# EAGLE design Encoder Rev 3 (pro micro) (EAGLE 6.2)
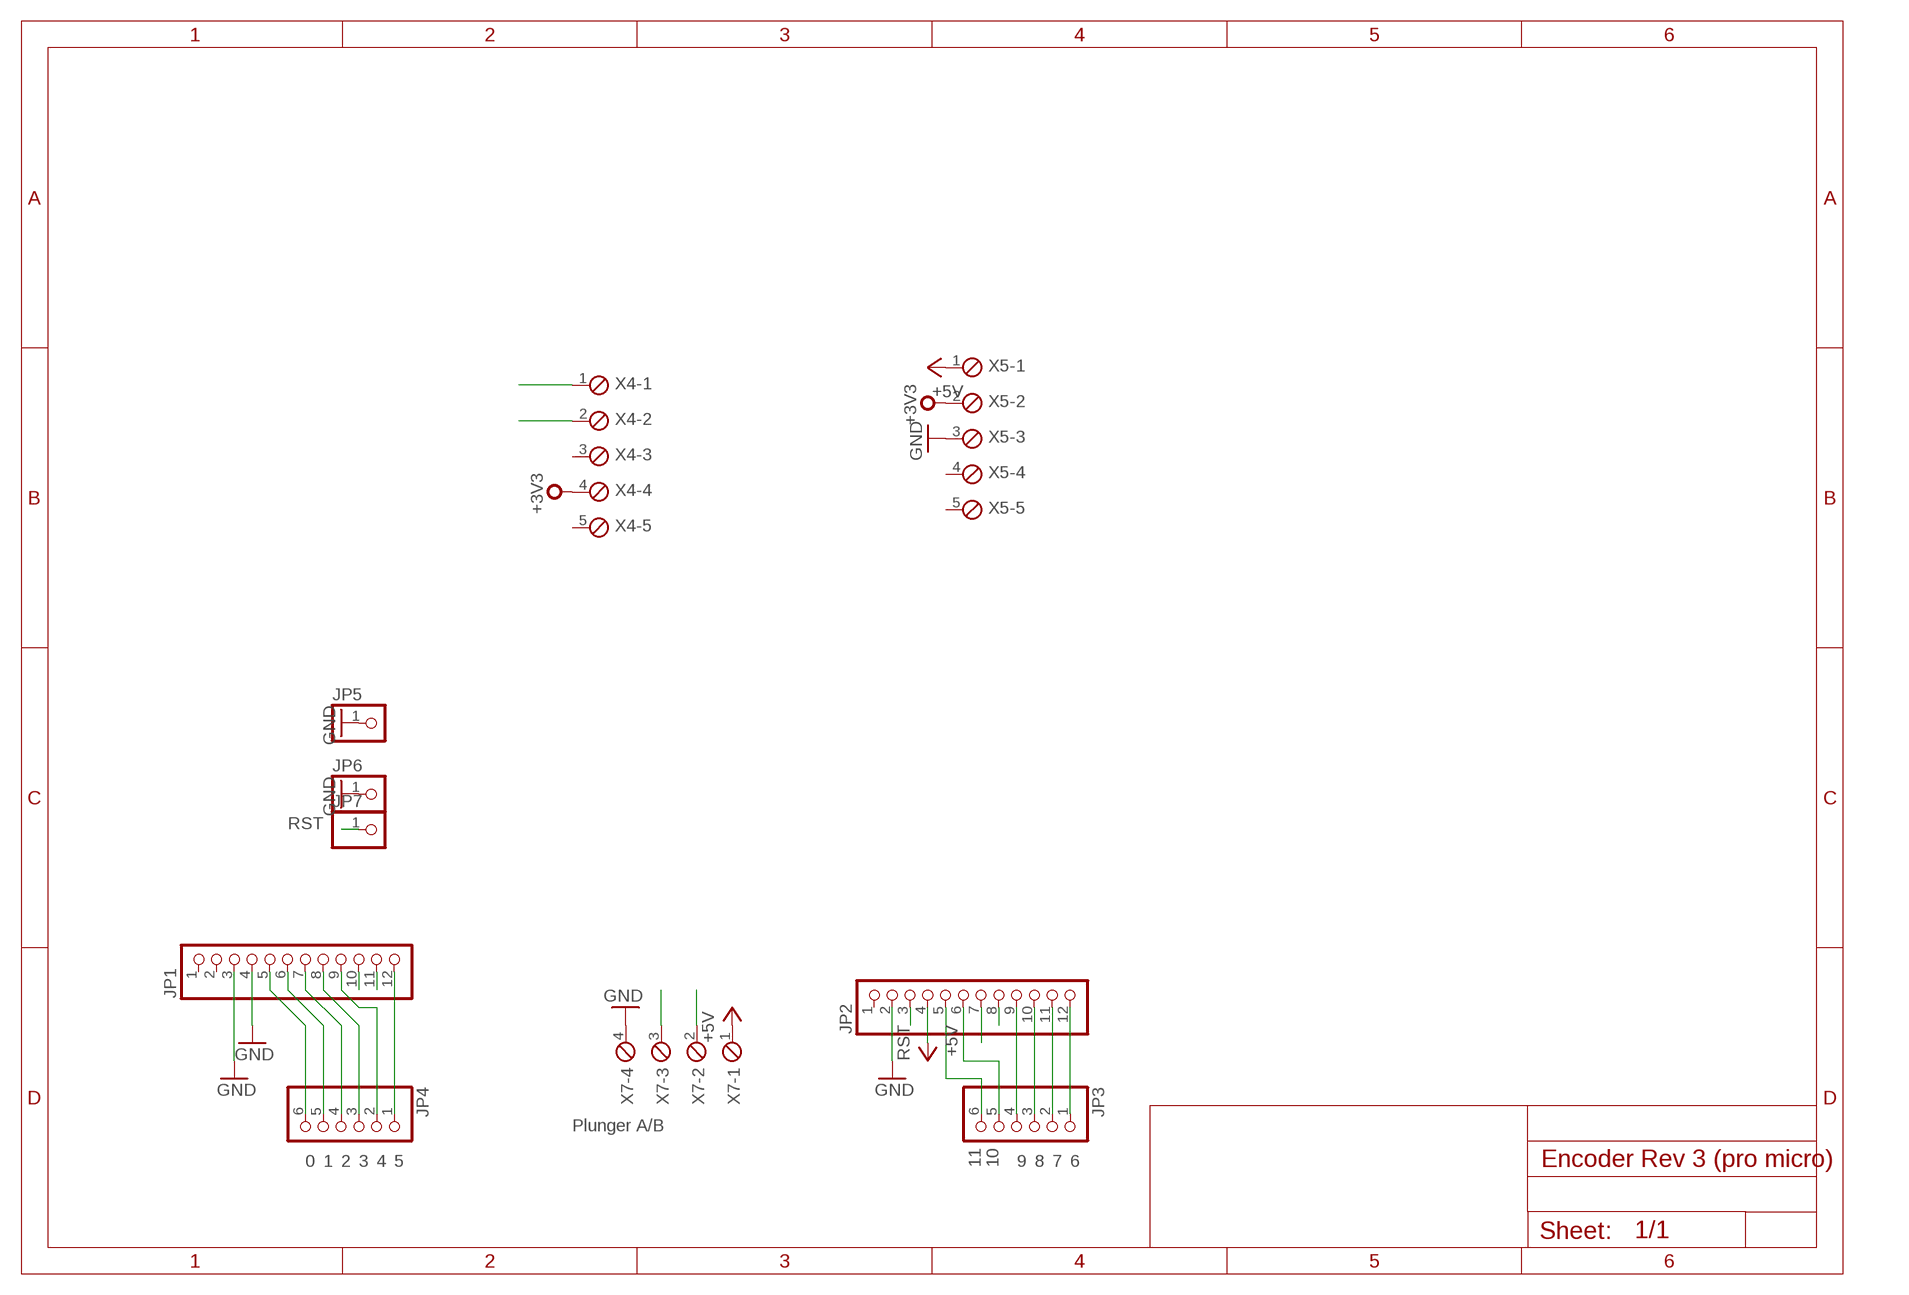
[diagram p0: schematic, sheet 1]

## Parts
JP1  PINHD-1X12-CB  [1X12-CB]
JP2  PINHD-1X12-CB  [1X12-CB]
JP3  PINHD-1X6B  [1X06-BIG]
JP4  PINHD-1X6B  [1X06-BIG]
JP5  PINHD-1X1CB  [1X01-CLEANBIG]
JP6  PINHD-1X1CB  [1X01-CLEANBIG]
JP7  PINHD-1X1CB  [1X01-CLEANBIG]
X4  MPT5  [5POL254]
X5  MPT5  [5POL254]
X7  MPT4  [4POL254]

## Nets
+3V3: X4.4 X5.2
+5V: JP2.4 X5.1 X7.1
A: JP1.10 X7.3
B: JP1.11 X7.2
GND: JP1.3 JP1.4 JP2.2 JP5.1 JP6.1 X5.3 X7.4
N$1: JP1.12 JP4.1
N$2: JP1.9 JP4.2
N$3: JP1.8 JP4.3
N$4: JP1.7 JP4.4
N$5: JP1.6 JP4.5
N$6: JP1.5 JP4.6
N$7: JP2.12 JP3.1
N$8: JP2.11 JP3.2
N$9: JP2.10 JP3.3
N$10: JP2.9 JP3.4
N$11: JP2.6 JP3.5
N$12: JP2.5 JP3.6
RST: JP2.3 JP7.1
XOUT: JP2.8 X4.1
YOUT: JP2.7 X4.2
Unconnected: JP1.1 JP1.2 JP2.1 X4.3 X4.5 X5.4 X5.5

## Notes on the sheet
- RST
- RST
- Plunger A/B
- 0 | 1 | 2 | 3 | 4 | 5 | 11 | 10 | 9 | 8 | 7 | 6

## Library data of the parts
JP1 JP2 = adafruit:PINHD-1X12: PIN HEADER
JP3 JP4 = adafruit:PINHD-1X6: PIN HEADER
JP5-JP7 = adafruit:PINHD-1X1: Pin header 1x1 for 0.1" spacing With round pins
X4 X5 = con-phoenix-254:MPT5: PHOENIX CONNECTOR; OC_FARNELL: unknown; OC_NEWARK: unknown
X7 = con-phoenix-254:MPT4: PHOENIX CONNECTOR; OC_FARNELL: unknown; OC_NEWARK: unknown

## Net classes
0 default: width 0.152 mm, clearance 0.203 mm

## Board
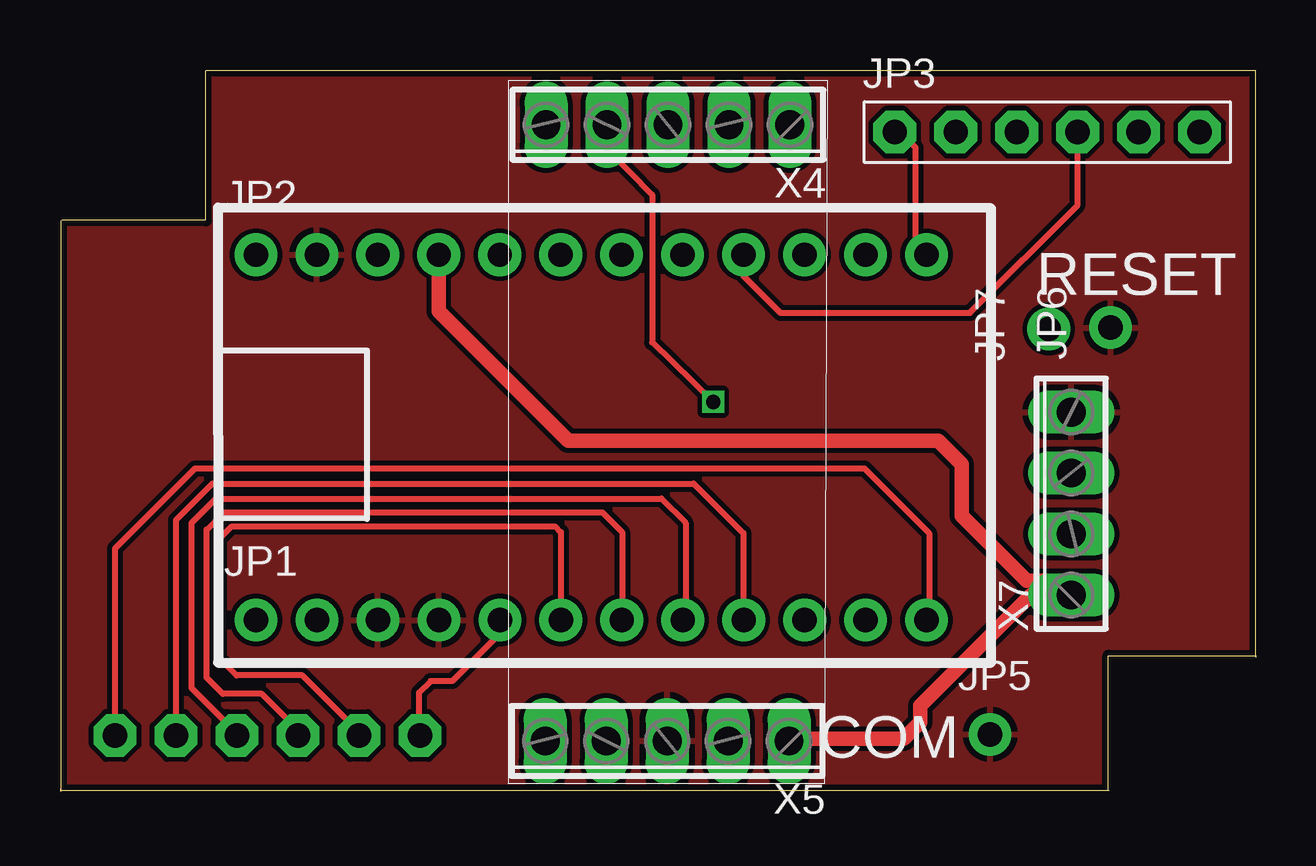
[diagram p1: board, top side]
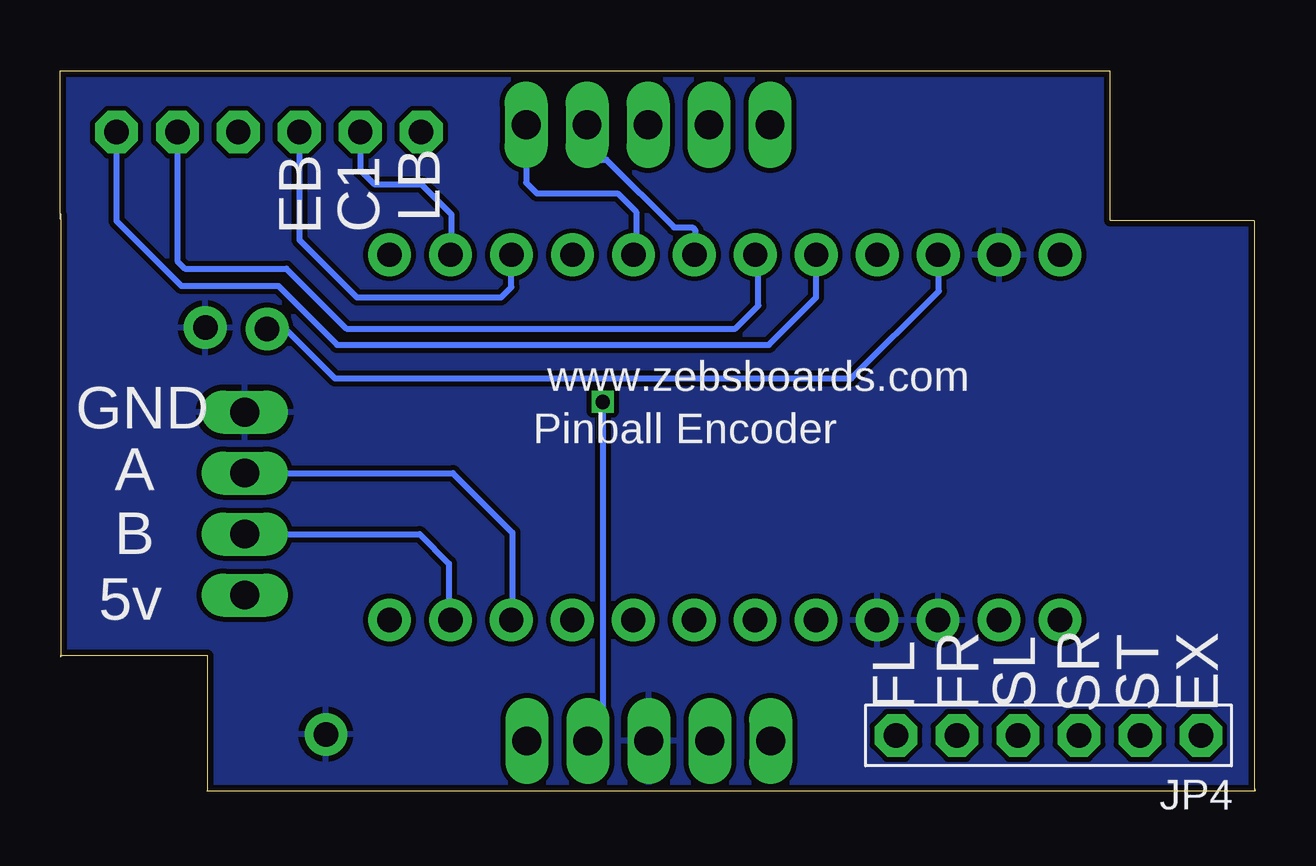
[diagram p2: board, bottom side, seen from below]

Size 49.83 x 30.01 mm. Coordinates in mm from the lower left corner, seen from the top.
Outline: 6.08,23.76 0.08,23.76
Outline: 6.07,23.76 6.07,30.01 49.83,30.01 49.83,23.8
Outline: 3.98,0 0.06,0
Outline: 0,0 0.06,0
Outline: 0.06,0 0.06,23.76
Outline: 43.68,0 43.68,5.62 49.83,5.62 49.83,5.57
Outline: 43.72,0 0.04,0 0.04,0.08
Outline: 49.81,24.05 49.81,5.59
Copper layers (1*16): Top 0.035mm / dielectric 1.5mm / Bottom 0.035mm
Design rules: minimum track width 6mil, minimum drill 12mil, track to track 6mil, track to pad 6mil, pad to pad 6mil, via to via 6mil, smd to smd 0mil, copper to edge 10mil, drill to drill 10mil, minimum pad ring 10mil, minimum via ring 6mil, stop-mask expansion 2mil, vias tented up to drill 100mil, thermal gap 10mil

### Footprints (pad centres in the part's own frame; a part is rotated, then mirrored left to right if it is on the bottom)
1X12-CB = drill 1.016 pad 1.778: 1 -13.97,0; 2 -11.43,0; 3 -8.89,0; 4 -6.35,0; 5 -3.81,0; 6 -1.27,0; 7 1.27,0; 8 3.81,0; 9 6.35,0; 10 8.89,0; 11 11.43,0; 12 13.97,0
1X06-BIG = drill 1.016 pad 1.778 octagon: 1 -6.35,0; 2 -3.81,0; 3 -1.27,0; 4 1.27,0; 5 3.81,0; 6 6.35,0
1X01-CLEANBIG = drill 1.016 pad 1.778: 1 0,0
5POL254 = drill 1.2 long: 1 -5.08,0; 2 -2.54,0; 3 0,0; 4 2.54,0; 5 5.08,0
4POL254 = drill 1.2 long: 1 -3.81,0; 2 -1.27,0; 3 1.27,0; 4 3.81,0

### Placement (x,y rotation side)
JP1  22.14,7.11 0 top
JP2  22.13,22.33 0 top
JP3  41.13,27.44 0 top
JP4  8.65,2.31 180 bottom
JP5  38.75,2.35 0 top
JP6  43.78,19.3 90 top
JP7  41.2,19.24 90 top
X4  25.33,27.75 180 top
X5  25.3,2.07 180 top
X7  42.13,11.97 90 top

### Tracks (layer width: path | path; a pad name or v marks a point on that pad's centre or on a via)
+3V3  (via drill 0.6)
  Top 0.254: X4.4 22.79,26.78 24.67,24.84 24.67,18.68 v27.22,16.2
  Bottom 0.254: v27.22,16.2 27.22,2.65 X5.2
+5V
  Top 0.61: X5.1 30.46,2.16 35.15,2.16 35.84,2.85 35.84,3.54 40.45,8.16 X7.1 41.54,8.74 40.28,8.74 37.57,11.46 37.57,13.6 36.59,14.58 21.18,14.58 15.78,19.98 JP2.4
A
  Bottom 0.254: X7.3 33.46,13.24 30.98,10.75 30.98,7.16 JP1.10
B
  Bottom 0.254: X7.2 34.85,10.7 33.62,9.47 33.62,7.17 JP1.11
GND
  pour Top: -0.09,30.61 50.86,30.61 50.86,-1.65 -0.1,-1.65 -0.1,30.6
  pour Bottom: -0.04,30.23 50.25,30.23 50.25,-0.44 -0.06,-0.44 -0.06,30.22
N$1
  Top 0.254: JP4.1 2.29,10.1 5.63,13.43 33.52,13.43 36.21,10.73 36.21,7.22 JP1.12
N$2
  Top 0.254: JP4.2 4.83,11.29 6.35,12.8 26.4,12.8 28.47,10.73 28.47,7.13 JP1.9
N$3
  Top 0.254: JP4.3 7.38,2.38 5.48,4.28 5.48,11.17 6.49,12.18 25.05,12.18 26.07,11.16 26.07,7.23 JP1.8
N$4
  Top 0.254: JP4.4 9.91,2.54 8.42,4.04 6.78,4.04 6.11,4.71 6.11,10.88 6.83,11.6 22.6,11.6 23.42,10.78 23.42,7.12 JP1.7
N$5
  Top 0.254: JP4.5 12.46,2.45 10.1,4.81 7.36,4.81 6.64,5.53 6.64,10.49 7.17,11.02 20.63,11.02 20.87,10.78 JP1.6
N$6
  Top 0.254: JP1.5 18.33,6.54 16.35,4.57 15.44,4.57 14.96,4.08 14.96,2.34 JP4.6
N$7
  Top 0.254: JP3.1 35.01,27.44 35.64,26.81 35.64,22.8 JP2.12
N$8
  Bottom 0.254: JP3.2 37.32,25.85 36.74,25.27 34.77,25.27 33.52,24.02 33.52,22.37 JP2.11
N$9
  Bottom 0.254: JP3.3 39.86,22.95 37.46,20.55 31.45,20.55 31.02,20.99 JP2.10
N$10
  Top 0.254: JP2.9 28.48,21.45 30.01,19.91 37.91,19.91 42.4,24.4 JP3.4
N$11
  Bottom 0.254: JP3.5 44.94,22.07 44.63,21.76 40.4,21.76 37.9,19.25 21.69,19.25 20.73,20.21 20.73,22.2 JP2.6
N$12
  Bottom 0.254: JP3.6 47.48,23.74 44.77,21.03 40.74,21.03 38.28,18.58 20.3,18.58 18.32,20.55 JP2.5
RST
  Bottom 0.254: JP7.1 40.44,19.24 38.38,17.18 16.86,17.18 13.22,20.82 13.22,22.31 JP2.3
XOUT
  Bottom 0.254: X4.1 30.41,25.33 29.96,24.89 26.6,24.89 25.83,24.12 25.83,22.45 JP2.8
YOUT
  Bottom 0.254: X4.2 27.43,27.75 27.43,26.3 27.07,26.3 24.24,23.47 23.48,23.47 23.36,23.35 23.36,22.38 JP2.7

### Text on the board
tPlace: RESET
bPlace: LB | C1 | EB | www.zebsboards.com | GND | Pinball Encoder | A | B | 5v | EX | ST | SR | SL | FR | FL
_tsilk: COM